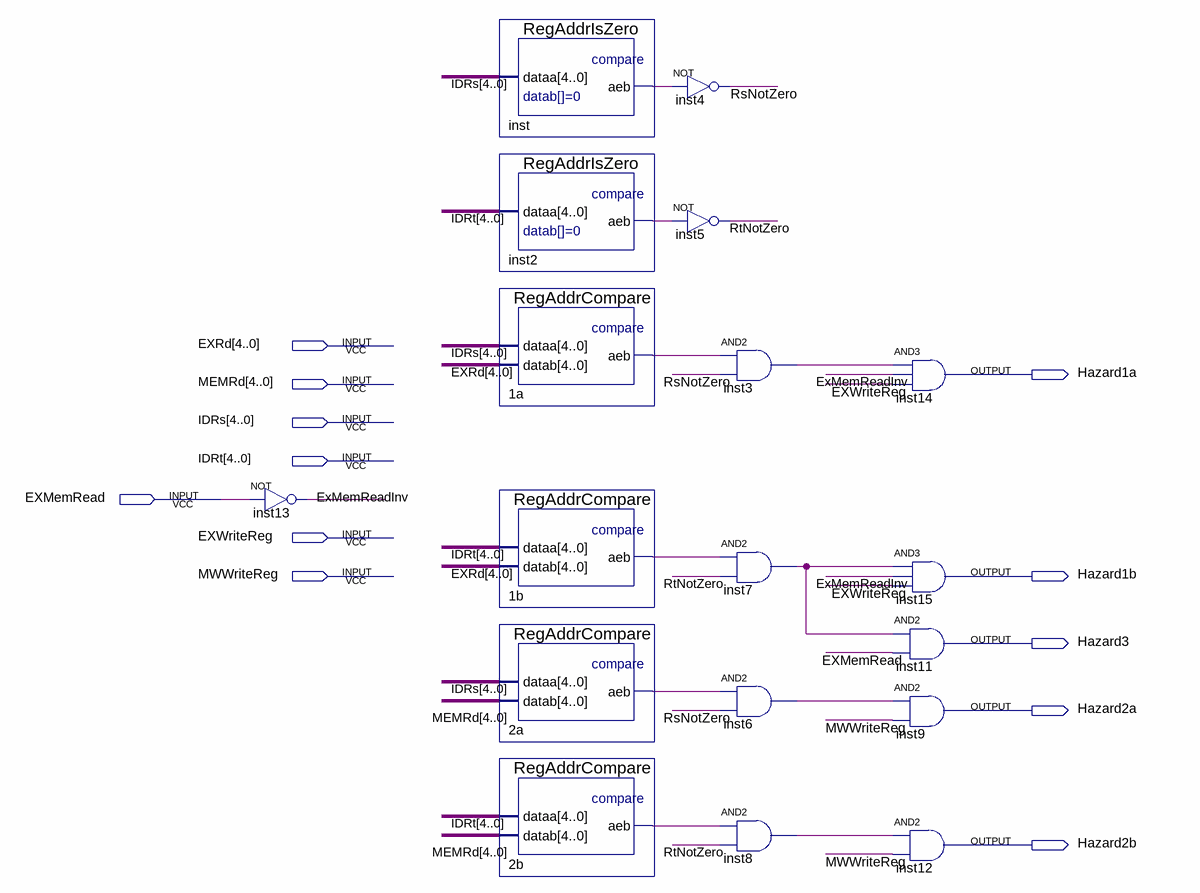
[diagram p0: schematic sheet]
// Quartus schematic HazardDetector.bdf as structural Verilog: 18 symbols, 12 pins
module HazardDetector (
  input  [4:0] EXRd,
  input  [4:0] MEMRd,
  input  [4:0] IDRs,
  input  [4:0] IDRt,
  input  EXMemRead,
  input  EXWriteReg,
  input  MWWriteReg,
  output Hazard1a,
  output Hazard1b,
  output Hazard3,
  output Hazard2a,
  output Hazard2b
);

  wire ExMemReadInv, inst2_aeb, inst3_out, inst6_out, inst7_out, inst8_out, inst_aeb, n1a_aeb, n1b_aeb,
       n2a_aeb, n2b_aeb, RsNotZero, RtNotZero;

  not inst13 (ExMemReadInv, EXMemRead);
  RegAddrIsZero inst (.dataa(IDRs), .aeb(inst_aeb));
  RegAddrIsZero inst2 (.dataa(IDRt), .aeb(inst2_aeb));
  RegAddrCompare u_1a (.dataa(IDRs), .datab(EXRd), .aeb(n1a_aeb));
  RegAddrCompare u_1b (.dataa(IDRt), .datab(EXRd), .aeb(n1b_aeb));
  RegAddrCompare u_2a (.dataa(IDRs), .datab(MEMRd), .aeb(n2a_aeb));
  RegAddrCompare u_2b (.dataa(IDRt), .datab(MEMRd), .aeb(n2b_aeb));
  not inst4 (RsNotZero, inst_aeb);
  not inst5 (RtNotZero, inst2_aeb);
  and inst3 (inst3_out, n1a_aeb, RsNotZero);
  and inst7 (inst7_out, n1b_aeb, RtNotZero);
  and inst6 (inst6_out, n2a_aeb, RsNotZero);
  and inst8 (inst8_out, n2b_aeb, RtNotZero);
  and inst14 (Hazard1a, inst3_out, ExMemReadInv, EXWriteReg);
  and inst15 (Hazard1b, inst7_out, ExMemReadInv, EXWriteReg);
  and inst11 (Hazard3, inst7_out, EXMemRead);
  and inst9 (Hazard2a, inst6_out, MWWriteReg);
  and inst12 (Hazard2b, inst8_out, MWWriteReg);
endmodule
